# Altium schematic sheet Power_Board_Components.SchDoc: Powerboard Components
size A4; Author: Ellen Wang; Organization: Waterloop; Address1: 200 University Ave W; Address2: Engineering 5, 1104; Address3: Waterloo, ON; Address4: N2LO 3G1; Revision: 1.1; SheetNumber: 2; SheetTotal: 2
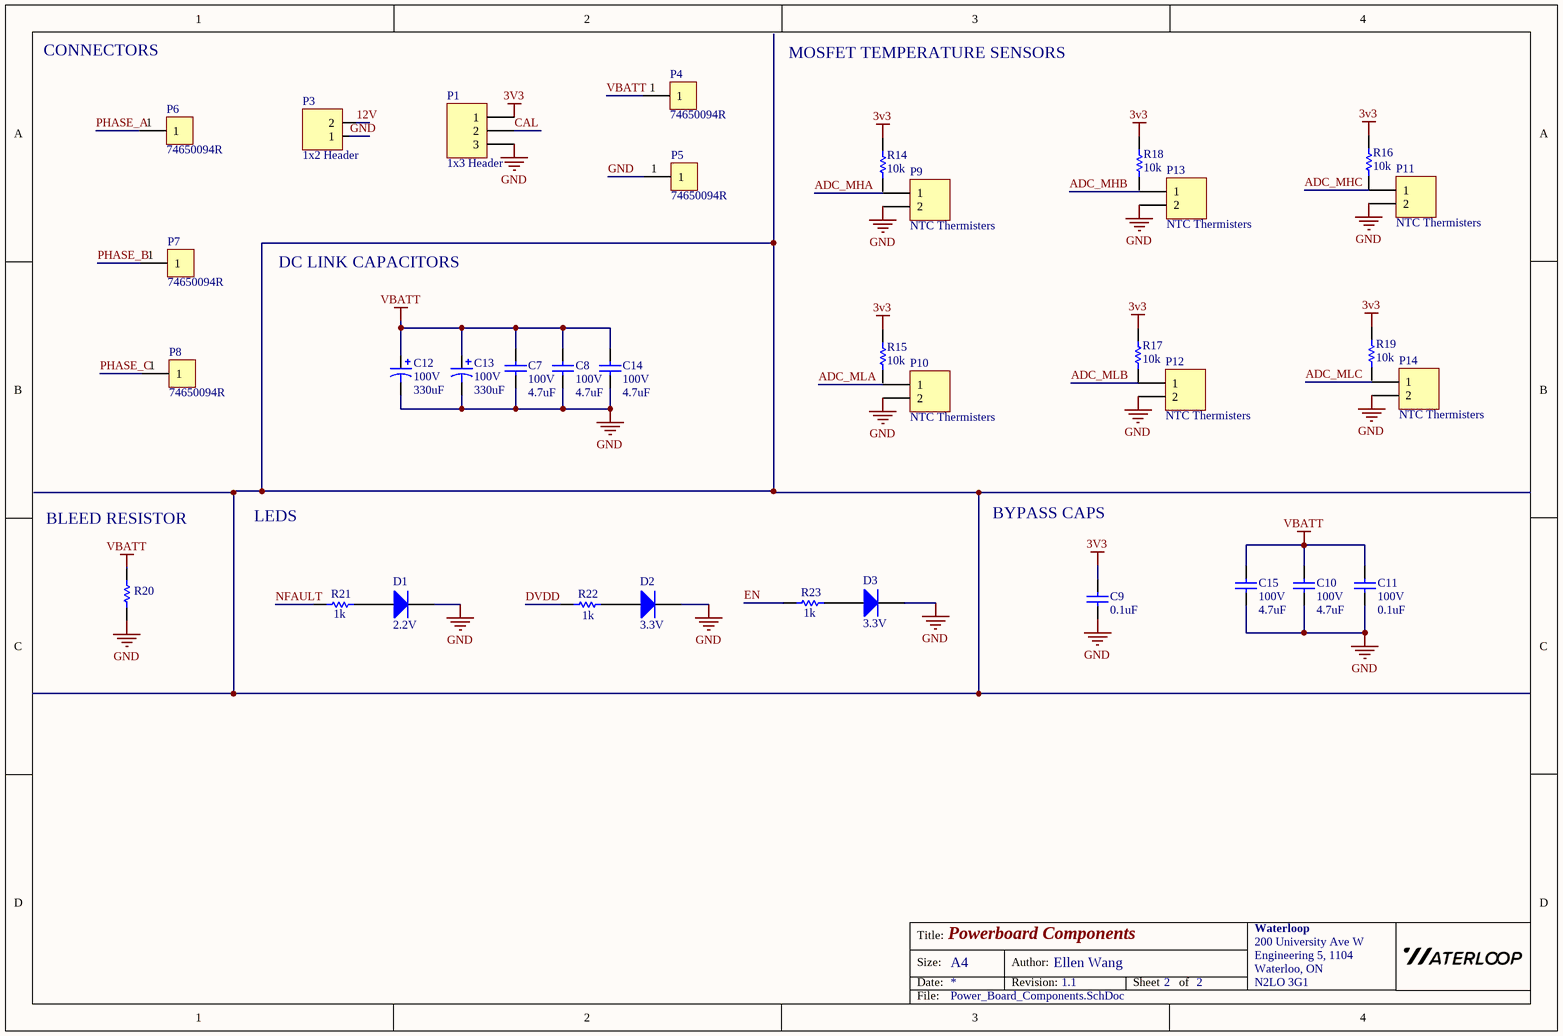
[diagram p0: Power_Board_Components.SchDoc]

## Parts
C7  value 4.7uF  Rating: 100V  [1210 - Capacitor]  (hidden comment: Capacitor - Nonpolarized)
C8  value 4.7uF  Rating: 100V  [1210 - Capacitor]  (hidden comment: Capacitor - Nonpolarized)
C9  value 0.1uF  [0805 - Capacitor]  (hidden comment: Capacitor - Nonpolarized)
C10  value 4.7uF  Rating: 100V  [1210 - Capacitor]  (hidden comment: Capacitor - Nonpolarized)
C11  value 0.1uF  Rating: 100V  [0805 - Capacitor]  (hidden comment: Capacitor - Nonpolarized)
C12  value 330uF  Rating: 100V  [OCVZ0606 - CAPACITOR]  (hidden comment: Capacitor - Polarized)
C13  value 330uF  Rating: 100V  [OCVZ0606 - CAPACITOR]  (hidden comment: Capacitor - Polarized)
C14  value 4.7uF  Rating: 100V  [1210 - Capacitor]  (hidden comment: Capacitor - Nonpolarized)
C15  value 4.7uF  Rating: 100V  [1210 - Capacitor]  (hidden comment: Capacitor - Nonpolarized)
D1  value 2.2V  [0805 - DIODE]  (hidden comment: Diode)
D2  value 3.3V  [0805 - DIODE]  (hidden comment: Diode)
D3  value 3.3V  [0805 - DIODE]  (hidden comment: Diode)
P1  1x3 Header  [HDR1X3]
P3  1x2 Header  [HDR1X2]
P4  74650094R  [74650094R]
P5  74650094R  [74650094R]
P6  74650094R  [74650094R]
P7  74650094R  [74650094R]
P8  74650094R  [74650094R]
P9  NTC Thermisters  [HDR1X2]
P10  NTC Thermisters  [HDR1X2]
P11  NTC Thermisters  [HDR1X2]
P12  NTC Thermisters  [HDR1X2]
P13  NTC Thermisters  [HDR1X2]
P14  NTC Thermisters  [HDR1X2]
R14  value 10k  [0603 - Resistor]  (hidden comment: Resistor)
R15  value 10k  [0603 - Resistor]  (hidden comment: Resistor)
R16  value 10k  [0603 - Resistor]  (hidden comment: Resistor)
R17  value 10k  [0603 - Resistor]  (hidden comment: Resistor)
R18  value 10k  [0603 - Resistor]  (hidden comment: Resistor)
R19  value 10k  [0603 - Resistor]  (hidden comment: Resistor)
R20  Resistor  [0603 - Resistor]  (value not drawn)  (no BOM)
R21  value 1k  [0603 - Resistor]  (hidden comment: Resistor)
R22  value 1k  [0603 - Resistor]  (hidden comment: Resistor)
R23  value 1k  [0603 - Resistor]  (hidden comment: Resistor)

## Nets
3V3: C9.1 P1.1 R14.2 R15.2 R16.2 R17.2 R18.2 R19.2
GND: C7.2 C8.2 C9.2 C10.2 C11.2 C12.2 C13.2 C14.2 C15.2 D1.2(K) D2.2(K) D3.2(K) P1.3 P3.1 P5.1 P9.2 P10.2 P11.2 P12.2 P13.2 P14.2 R20.1
VBATT: C7.1 C8.2 C10.2 C11.2 C12.1 C13.1 C14.2 C15.2 P4.1 R20.2
12V: P3.2
ADC_MHA: P9.1
ADC_MHB: P13.1
ADC_MHC: P11.1
ADC_MLA: P10.1
ADC_MLB: P12.1
ADC_MLC: P14.1
CAL: P1.2
DVDD: R22.1
EN: R23.1
NFAULT: R21.1
PHASE_A: P6.1
PHASE_B: P7.1
PHASE_C: P8.1
NetD1_1: D1.1(A) R21.2
NetD2_1: D2.1(A) R22.2
NetD3_1: D3.1(A) R23.2

Not connected (* = marked no-connect by the designer): R14 1; R15 1; R16 1; R17 1; R18 1; R19 1

## Notes on the sheet
- CONNECTORS
- MOSFET TEMPERATURE SENSORS
- DC LINK CAPACITORS
- BYPASS CAPS
- (near R20) BLEED RESISTOR
- LEDS
- (near R20) DNP
- Title:
- Size:
- Date:
- A4
- Author:
- Revision:
- Sheet
- of
- File:

## Library data of the parts
C7 C8 C10 C14 C15 = Capacitor - Nonpolarized: Nonpolarized Capacitor; Manufacturer: Holy Stone Enterprise Co., Ltd.; Manufacturer Part Number: C1210X475K101T; Supplier Part Number: 2873-C1210X475K101TCT-ND; Supplier: Digikey
C9 = Capacitor - Nonpolarized: Nonpolarized Capacitor; Manufacturer: Samsung Electro-Mechanics; Manufacturer Part Number: CL21B104KCFWPNE; Rating: 100V; Supplier Part Number: 1276-6733-1-ND; Supplier: Digikey
C11 = Capacitor - Nonpolarized: Nonpolarized Capacitor; Manufacturer: Samsung Electro-Mechanics; Manufacturer Part Number: CL21B104KCFWPNE; Supplier Part Number: 1276-6733-1-ND; Supplier: Digikey
C12 C13 = Capacitor - Polarized: Polarized Capacitor; Manufacturer: Panasonic Electronic Components; Manufacturer Part Number: EEE-FK2A331AM; Supplier: Digikey; Supplier Part Number: PCE4867CT-ND
D1 = Diode: Manufacturer: SunLED; Manufacturer Part Number: XZM2CRK54WRP-1; Rating: *; Supplier Part Number: 1497-XZM2CRK54WRP-1CT-ND; Supplier: Digikey
D2 D3 = Diode: Manufacturer: SunLED; Manufacturer Part Number: XZDGK54W-8; Rating: *; Supplier Part Number: 1497-1435-1-ND; Supplier: Digkey
P1 = 1x3 Header: 1x3 Pin Header
P3 = 1x2 Header: 1x2 Pin Header
P4-P8 = 74650094R: Manufacturer: Wurth; Manufacturer Part Number: 74650094R; Supplier Part Number: 732-10884-1-ND; Supplier: Digikey
P9-P14 = Header 2: Header, 2-Pin; LatestRevisionDate: 17-Jul-2002; LatestRevisionNote: Re-released for DXP Platform.; Publisher: Altium Limited
R20 = Resistor: Rating: 100V; Manufacturer Part Number: *; Manufacturer: *; Supplier Part Number: *; Supplier: *; Value: *
R14-R19 R21-R23 = Resistor: Rating: *; Manufacturer Part Number: *; Manufacturer: *; Supplier Part Number: *; Supplier: *